# Altium schematic sheet A-GSM.SchDoc
size A3; SheetNumber: 02; SheetTotal: 03; PageSetup: Record=PageOptions|CenterHorizontal=True|CenterVertical=True|PrintScale=1.04|XCorrection=1.00|YCorrection=1.00|PrintKind=1|BorderSize=5000000|LeftOffset=0|BottomOffset=0|Orientation=2|PaperLength=1000|PaperWidth=1000|Scale=100|PaperSource=7|PrintQuality=600|MediaType=1|DitherType=10|PrintScaleMode=1|PaperKind=A3|PaperIndex=8
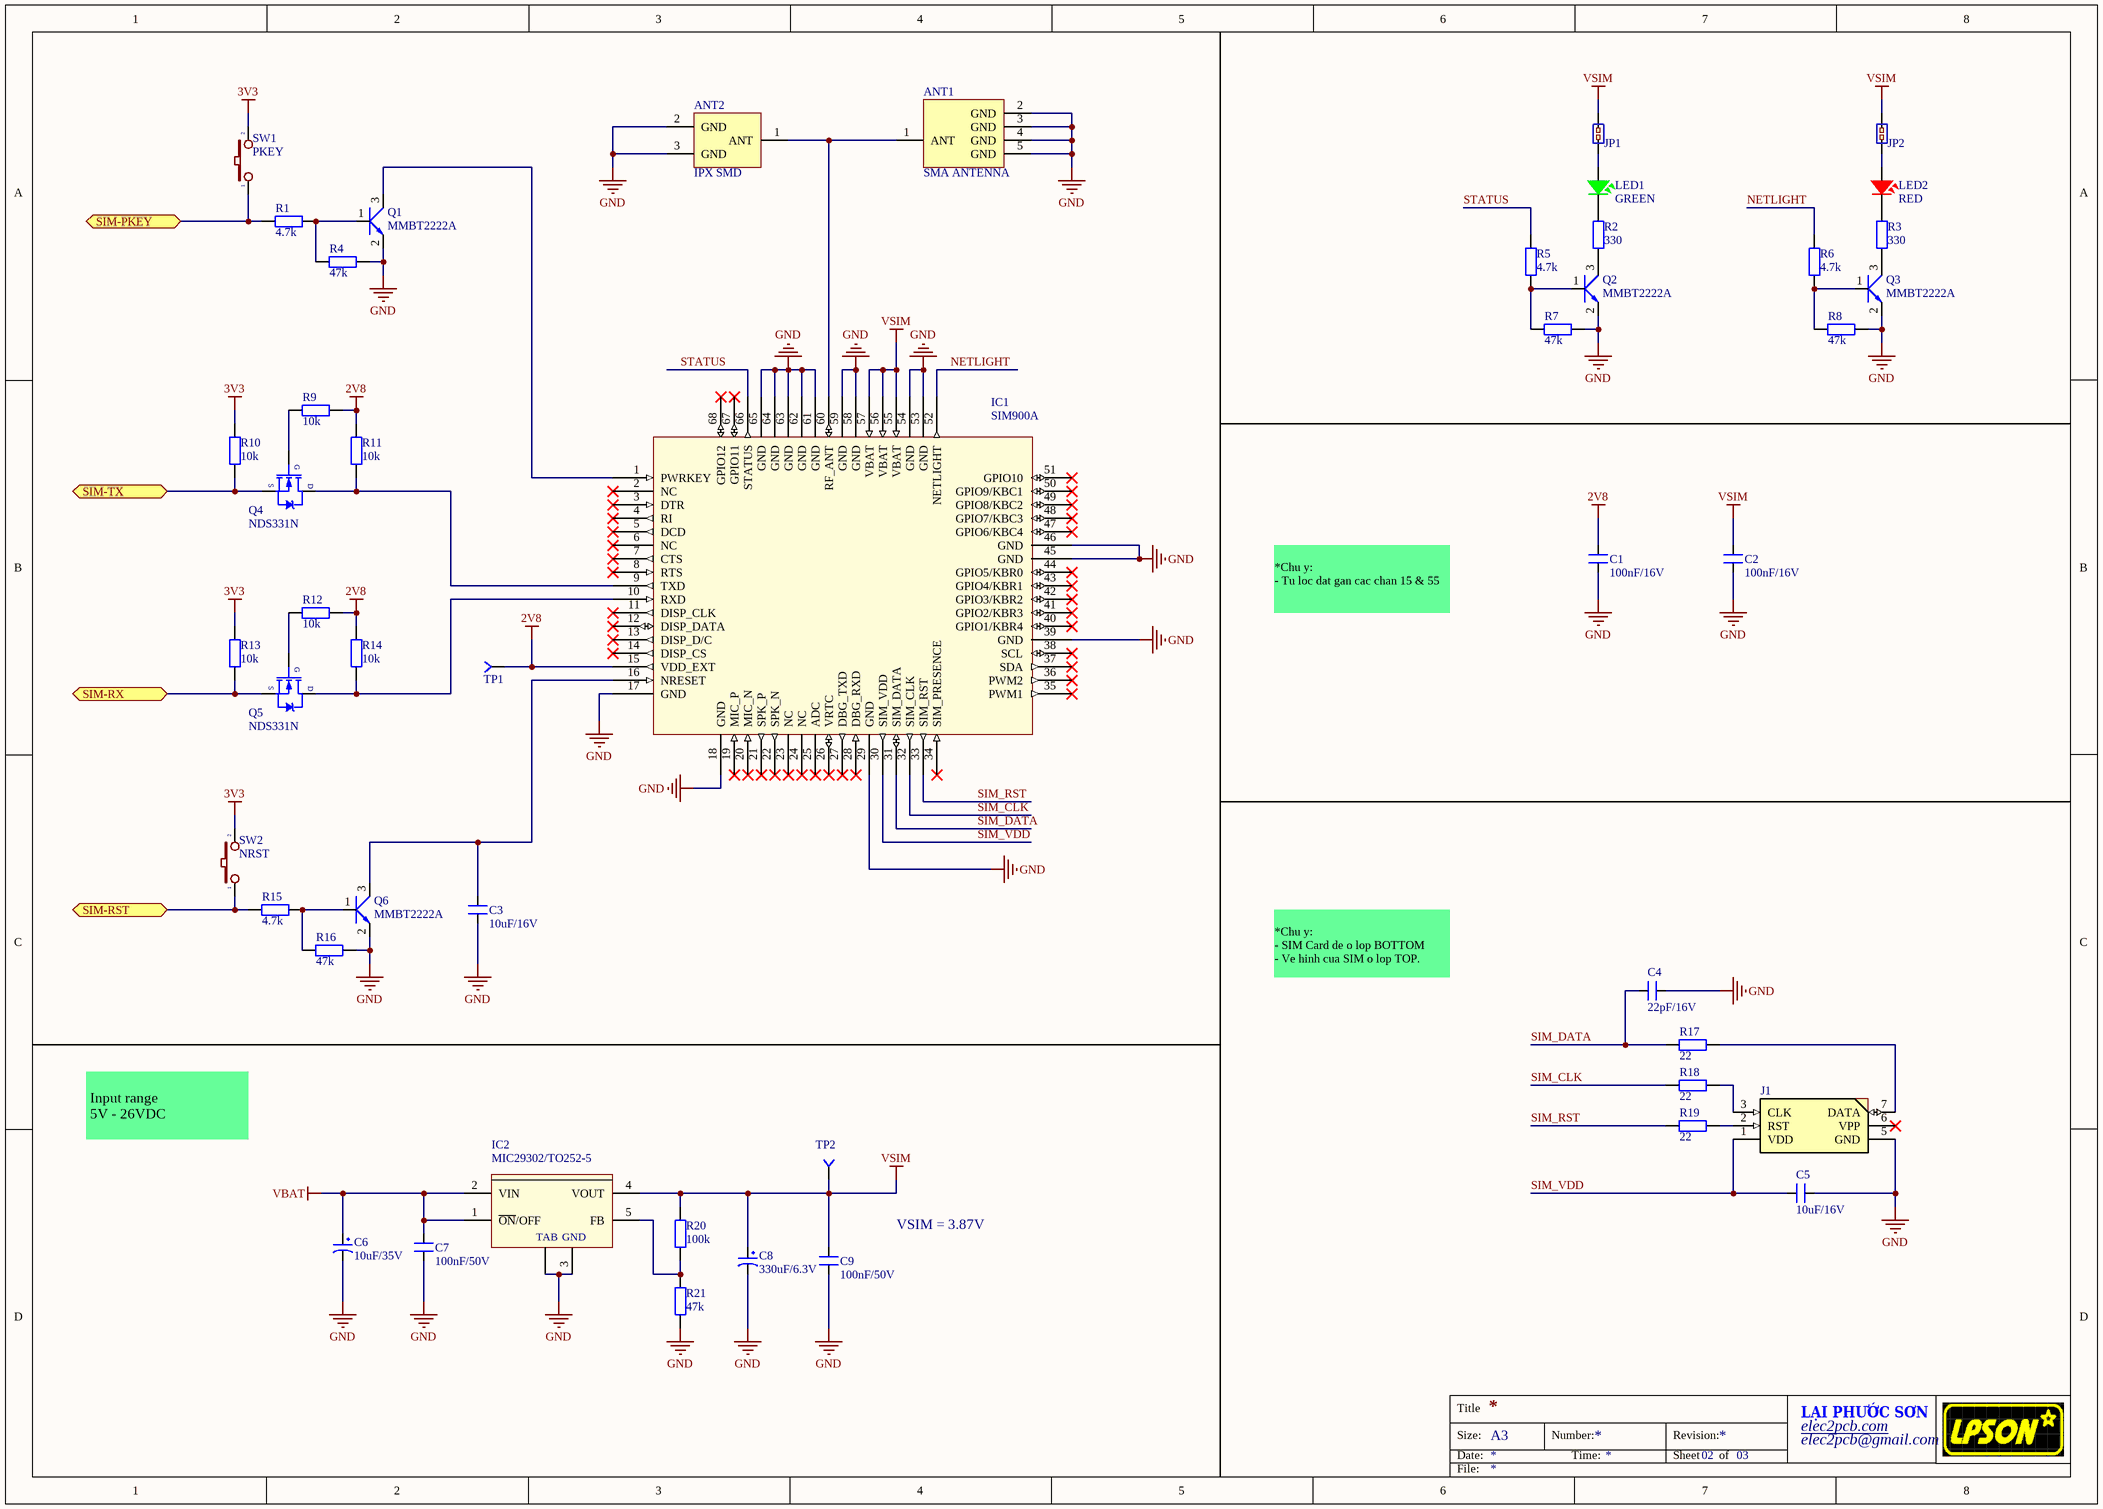
[diagram p0: A-GSM.SchDoc]

## Parts
ANT1  value SMA ANTENNA  [ANT-SMA-ST-F]  (hidden comment: ANTEN-SMA)
ANT2  value IPX SMD  [ANT-IPX-SMD]  (hidden comment: ANTEN-IPX)
C1  100nF/16V  [C0805-2012]
C2  100nF/16V  [C0805-2012]
C3  10uF/16V  [C0805-2012]
C4  22pF/16V  [C0603-1608]
C5  10uF/16V  [C0805-2012]
C6  10uF/35V  [CAP_TANTA_10UF_35V]
C7  100nF/50V  [C0805-2012]
C8  330uF/6.3V  [CAP_TANTA-3528]
C9  100nF/50V  [C0805-2012]
IC1  SIM900A/SIMCOM  [SIM900A]  (value not drawn)
IC2  MIC29302/TO252-5  [MIC29302A]
J1  SIM-FMS006-2620-0  [SIM-FMS006-2620-0]  (value not drawn)
JP1  JP2-ShortingJumper  [Header_2]  (value not drawn)
JP2  JP2-ShortingJumper  [Header_2]  (value not drawn)
LED1  GREEN  [Led 0805G]
LED2  RED  [Led 0805R]
Q1  MMBT2222A  [MMBT2222A]
Q2  MMBT2222A  [MMBT2222A]
Q3  MMBT2222A  [MMBT2222A]
Q4  NDS331N  [NDS331N]
Q5  NDS331N  [NDS331N]
Q6  MMBT2222A  [MMBT2222A]
R1  Resistance (Ohms): 4.7k  [RESC2012(0805)]
R2  Resistance (Ohms): 330  [RESC2012(0805)]
R3  Resistance (Ohms): 330  [RESC2012(0805)]
R4  Resistance (Ohms): 47k  [RESC2012(0805)]
R5  Resistance (Ohms): 4.7k  [RESC2012(0805)]
R6  Resistance (Ohms): 4.7k  [RESC2012(0805)]
R7  Resistance (Ohms): 47k  [RESC2012(0805)]
R8  Resistance (Ohms): 47k  [RESC2012(0805)]
R9  Resistance (Ohms): 10k  [RESC2012(0805)]
R10  Resistance (Ohms): 10k  [RESC2012(0805)]
R11  Resistance (Ohms): 10k  [RESC2012(0805)]
R12  Resistance (Ohms): 10k  [RESC2012(0805)]
R13  Resistance (Ohms): 10k  [RESC2012(0805)]
R14  Resistance (Ohms): 10k  [RESC2012(0805)]
R15  Resistance (Ohms): 4.7k  [RESC2012(0805)]
R16  Resistance (Ohms): 47k  [RESC2012(0805)]
R17  Resistance (Ohms): 22  [RESC2012(0805)]
R18  Resistance (Ohms): 22  [RESC2012(0805)]
R19  Resistance (Ohms): 22  [RESC2012(0805)]
R20  Resistance (Ohms): 100k  [RESC2012(0805)]
R21  Resistance (Ohms): 47k  [RESC2012(0805)]
SW1  PKEY  [BTN-EVQ-11A04M]
SW2  NRST  [BTN-EVQ-11A04M]
TP1  Test Point  [Test_point_VIA06]  (value not drawn)
TP2  Test Point  [Test_point_VIA06]  (value not drawn)

## Ports
SIM-PKEY (bidir), SIM-RST (bidir), SIM-RX (bidir), SIM-TX (bidir)

## Nets
2V8: C1.1 IC1.15(VDD_EXT) R9.2 R11.1 R12.2 R14.1 TP1.1
3V3: R10.1 R13.1 SW1.2 SW2.2
GND: ANT1.2(GND) ANT1.3(GND) ANT1.4(GND) ANT1.5(GND) ANT2.2(GND) ANT2.3(GND) C1.2 C2.2 C3.2 C4.2 C5.2 C6.2 C7.2 C8.2 C9.2 IC1.17(GND) IC1.18(GND) IC1.29(GND) IC1.39(GND) IC1.45(GND) IC1.46(GND) IC1.53(GND) IC1.54(GND) IC1.58(GND) IC1.59(GND) IC1.61(GND) IC1.62(GND) IC1.63(GND) IC1.64(GND) IC1.65(GND) IC2.3(GND) IC2.6(TAB) J1.5(GND) Q1.2(E) Q2.2(E) Q3.2(E) Q6.2(E) R4.2 R7.2 R8.2 R16.2 R21.1
VBAT: C6.1 C7.1 IC2.1(~{ON}/OFF) IC2.2(VIN)
VSIM: C2.1 C8.1 C9.1 IC1.55(VBAT) IC1.56(VBAT) IC1.57(VBAT) IC2.4(VOUT) JP1.2 JP2.2 R20.1 TP2.1
NETLIGHT: IC1.52(NETLIGHT) R6.2
SIM-PKEY: R1.1 SW1.1 ; port SIM-PKEY
SIM-RST: R15.1 SW2.1 ; port SIM-RST
SIM-RX: Q5.2(S) R13.2 ; port SIM-RX
SIM-TX: Q4.2(S) R10.2 ; port SIM-TX
SIM_CLK: IC1.32(SIM_CLK) R18.2
SIM_DATA: C4.1 IC1.31(SIM_DATA) R17.2
SIM_RST: IC1.33(SIM_RST) R19.2
SIM_VDD: C5.1 IC1.30(SIM_VDD) J1.1(VDD)
STATUS: IC1.66(STATUS) R5.2
NetANT1_1: ANT1.1(ANT) ANT2.1(ANT) IC1.60(RF_ANT)
NetC3_1: C3.1 IC1.16(NRESET) Q6.3(C)
NetIC1_1: IC1.1(PWRKEY) Q1.3(C)
NetIC1_9: IC1.9(TXD) Q4.3(D) R11.2
NetIC1_10: IC1.10(RXD) Q5.3(D) R14.2
NetIC2_5: IC2.5(FB) R20.2 R21.2
NetJ1_2: J1.2(RST) R19.1
NetJ1_3: J1.3(CLK) R18.1
NetJ1_7: J1.7(DATA) R17.1
NetJP1_1: JP1.1 LED1.1(A)
NetJP2_1: JP2.1 LED2.1(A)
NetLED1_2: LED1.2(K) R2.2
NetLED2_2: LED2.2(K) R3.2
NetQ1_1: Q1.1(B) R1.2 R4.1
NetQ2_1: Q2.1(B) R5.1 R7.1
NetQ2_3: Q2.3(C) R2.1
NetQ3_1: Q3.1(B) R6.1 R8.1
NetQ3_3: Q3.3(C) R3.1
NetQ4_1: Q4.1(G) R9.1
NetQ5_1: Q5.1(G) R12.1
NetQ6_1: Q6.1(B) R15.2 R16.1

Not connected (* = marked no-connect by the designer): IC1 2(NC)* 3(DTR)* 4(RI)* 5(DCD)* 6(NC)* 7(CTS)* 8(RTS)* 11(DISP_CLK)* 12(DISP_DATA)* 13(DISP_D/C)* 14(DISP_CS)* 19(MIC_P)* 20(MIC_N)* 21(SPK_P)* 22(SPK_N)* 23(NC)* 24(NC)* 25(ADC)* 26(VRTC)* 27(DBG_TXD)* 28(DBG_RXD)* 34(SIM_PRESENCE)* 35(PWM1)* 36(PWM2)* 37(SDA)* 38(SCL)* 40(GPIO1/KBR4)* 41(GPIO2/KBR3)* 42(GPIO3/KBR2)* 43(GPIO4/KBR1)* 44(GPIO5/KBR0)* 47(GPIO6/KBC4)* 48(GPIO7/KBC3)* 49(GPIO8/KBC2)* 50(GPIO9/KBC1)* 51(GPIO10)* 67(GPIO11)* 68(GPIO12)*; J1 6(VPP)*

## Notes on the sheet
- *Chu y:
  - Tu loc dat gan cac chan 15 & 55
- *Chu y:
  - SIM Card de o lop BOTTOM
  - Ve hinh cua SIM o lop TOP.
- Input range
  5V - 26VDC
- VSIM = 3.87V
- Title
- Size:
- Date:
- A3
- Number:
- Time:
- Revision:
- Sheet
- of
- LẠI PHƯỚC SƠN
- elec2pcb@gmail.com
- elec2pcb.com
- File:

## Library data of the parts
ANT1 = ANTEN-SMA: SMA Right-Angle PCB Female Antenna; Supplier Link: http://tme.vn/Product.aspx?id=1981#page=pro_info; ComponentLink1Description: http://tme.vn/upload/PICTURE/SMA-ST-DIM.gif; ComponentLink1URL: http://tme.vn/upload/PICTURE/SMA-ST-DIM.gif; Supplier 1: TME.VN
ANT2 = ANTEN-IPX: IPX, SMD, ANTENNA; Supplier Link: http://tme.vn/Product.aspx?id=1106#page=pro_info; ComponentLink1Description: http://tme.vn/upload/pdf/IPXSM66AL.pdf; ComponentLink1URL: http://tme.vn/upload/pdf/IPXSM66AL.pdf; Supplier 1: TME.VN
C1 C2 = CAP-CER/100nF/16V/X7R/0805: CAP CER 0.1UF 16V X7R 0805; Manufacturer: Kemet; Manufacturer Part Number: C0805C104K4RACTU; Capacitance: 0.10µF; Tolerance: ±10%; Supplier 1: Digi-Key; RoHS: RoHS Compliant; Category: Capacitors; Stock 1: 366123; Pricing 1: 1=0.11, 10=0.075, 50=0.0432, 100=0.0356, 250=0.03, 500=0.02512, 1000=0.02063 (USD); Packaging: Cut Tape (CT); Voltage - Rated: 16V; Temperature Coefficient: X7R; Mounting Type: Surface Mount, MLCC; Operating Temperature: -55°C ~ 125°C; Applications: General Purpose; Ratings: -; Package / Case: 0805 (2012 Metric); Size / Dimension: 0.079" L x 0.049" W (2.00mm x 1.25mm); Height - Seated (Max): -; Thickness (Max): 0.035" (0.88mm); Lead Spacing: -; Features: Low ESL; Lead Style: -; ComponentLink1URL: http://www.kemet.com/docfinder?Partnumber=C0805C104K4RACTU; ComponentLink1Description: http://www.kemet.com/docfinder?Partnumber=C0805C104K4RACTU; Supplier Part Number 1: 399-1167-1-ND
C3 C5 = CAP-CER/10UF/16V/X5R/0805: CAP CER 10UF 16V X5R 0805; Manufacturer: Murata Electronics North America; Manufacturer Part Number: GRM21BR61C106KE15L; Capacitance: 10µF; Tolerance: ±10%; Supplier 1: Digi-Key; Supplier Part Number 1: 490-3886-1-ND; Stock: 1364697; Pricing: 1=0.2, 10=0.136, 50=0.0826, 100=0.0693, 250=0.05612, 500=0.0495, 1000=0.04208 (USD); Packaging: Cut Tape (CT); Voltage - Rated: 16V; Temperature Coefficient: X5R; Mounting Type: Surface Mount, MLCC; Operating Temperature: -55°C ~ 85°C; Applications: General Purpose; Ratings: -; Package / Case: 0805 (2012 Metric); Size / Dimension: 0.079" L x 0.049" W (2.00mm x 1.25mm); Height - Seated (Max): -; Thickness (Max): 0.053" (1.35mm); Lead Spacing: -; Features: -; Lead Style: -; ComponentLink1URL: http://www.murata.com/~/media/webrenewal/support/library/catalog/products/capacitor/mlcc/c02e.ashx; ComponentLink1Description: http://www.murata.com/~/media/webrenewal/support/library/catalog/products/capacitor/mlcc/c02e.ashx
C4 = CAP-CER/22pF/16V/NP0/0603: CAP CER 22PF 16V NP0 0603; Manufacturer: Kemet; Manufacturer Part Number: C0603C220K4GACTU; Tolerance: ±10%; Temperature Coefficient: C0G, NP0; Supplier 1: Digi-Key; Supplier Part Number 1: 399-9031-1-ND; Stock: 40435; Pricing: 1=0.1, 10=0.055, 25=0.0392, 50=0.0298, 100=0.0252, 250=0.02064, 1000=0.0135 (USD); Packaging: Cut Tape (CT); Capacitance: 22pF; Voltage - Rated: 16V; Mounting Type: Surface Mount, MLCC; Operating Temperature: -55°C ~ 125°C; Applications: General Purpose; Ratings: -; Package / Case: 0603 (1608 Metric); Size / Dimension: 0.063" L x 0.031" W (1.60mm x 0.80mm); Height - Seated (Max): -; Thickness (Max): 0.034" (0.87mm); Lead Spacing: -; Features: -; Lead Style: -; ComponentLink1URL: http://www.kemet.com/docfinder?Partnumber=C0603C220K4GACTU; ComponentLink1Description: http://www.kemet.com/docfinder?Partnumber=C0603C220K4GACTU
C6 = CAP-TANT/10uF/35V/2413: CAP TANT 10UF 35V 10% 2413; Manufacturer: Kemet; Manufacturer Part Number: T491C106K035AT; Manufacturer Size Code: C; Capacitance: 10µF; ESR (Equivalent Series Resistance): 1.6 Ohm; Type: Molded; Lifetime @ Temp.: 2000 Hrs @ 85°C; Supplier 1: Digi-Key; RoHS: RoHS Compliant; Category: Capacitors; Stock 1: 21227; Pricing 1: 1=0.99, 10=0.838, 50=0.6166, 100=0.4901, 250=0.41108 (USD); Packaging: Cut Tape (CT); Tolerance: ±10%; Voltage - Rated: 35V; Operating Temperature: -55°C ~ 125°C; Mounting Type: Surface Mount; Package / Case: 2413 (6032 Metric); Size / Dimension: 0.236" L x 0.126" W (6.00mm x 3.20mm); Height - Seated (Max): 0.110" (2.80mm); Lead Spacing: -; Features: General Purpose; ComponentLink1URL: http://www.kemet.com/Lists/ProductCatalog/Attachments/254/KEM_T2005_T491.pdf; ComponentLink1Description: http://www.kemet.com/Lists/ProductCatalog/Attachments/254/KEM_T2005_T491.pdf; Supplier Part Number 1: 399-8333-1-ND
C7 C9 = CAP-CER/100nF/50V/X7R/0805: CAP CER 0.1UF 50V X7R 0805; Manufacturer: AVX Corporation; Manufacturer Part Number: 08055C104KAT2A; Capacitance: 0.10µF; Tolerance: ±10%; Supplier 1: Digi-Key; RoHS: RoHS Compliant; Category: Capacitors; Stock 1: 6127704; Pricing 1: 1=0.1, 10=0.036, 100=0.0165, 250=0.01352, 500=0.01156, 1000=0.009 (USD); Packaging: Cut Tape (CT); Voltage - Rated: 50V; Temperature Coefficient: X7R; Mounting Type: Surface Mount, MLCC; Operating Temperature: -55°C ~ 125°C; Applications: General Purpose; Ratings: -; Package / Case: 0805 (2012 Metric); Size / Dimension: 0.079" L x 0.049" W (2.01mm x 1.25mm); Height - Seated (Max): -; Thickness (Max): 0.037" (0.94mm); Lead Spacing: -; Features: -; Lead Style: -; ComponentLink1URL: http://datasheets.avx.com/X7RDielectric.pdf; ComponentLink1Description: http://datasheets.avx.com/X7RDielectric.pdf; Supplier Part Number 1: 478-1395-1-ND
C8 = CAP-TANT/330uF/6.3V/3528: CAP TAN 330UF 20% 6V 3528-21; Manufacturer: Kemet; Manufacturer Part Number: T490B337M006ATE800; Manufacturer Size Code: B; Capacitance: 330µF; Voltage - Rated: 6.3V; ESR (Equivalent Series Resistance): 800 mOhm; Type: Molded; Lifetime @ Temp.: 1000 Hrs @ 85°C; Supplier 1: Digi-Key; RoHS: RoHS Compliant; Category: Capacitors; Stock 1: 5471; Pricing 1: 1=1.21, 10=1.011, 50=0.817, 100=0.645, 250=0.53752, 500=0.48376, 1000=0.44075 (USD); Packaging: Cut Tape (CT); Tolerance: ±20%; Operating Temperature: -55°C ~ 40°C; Mounting Type: Surface Mount; Package / Case: 1411 (3528 Metric); Size / Dimension: 0.138" L x 0.110" W (3.50mm x 2.80mm); Height - Seated (Max): 0.083" (2.10mm); Lead Spacing: -; Features: General Purpose; ComponentLink1URL: http://capacitoredge.kemet.com/capedge2/DataSheet?pn=T490B337M006ATE800; ComponentLink1Description: http://capacitoredge.kemet.com/capedge2/DataSheet?pn=T490B337M006ATE800; Supplier Part Number 1: 399-11976-1-ND
IC1 = SIM900A/SIMCOM: SIM900A, Dual-band GSM/GPRS 900/1800MHz Module; Manufacturer: SIMCOM; ComponentLink1Description: http://www.tme.vn/upload/pdf/SIM900A_HD_V1.01.pdf; Supplier Link: http://www.tme.vn/Product.aspx?id=1575#page=pro_info; ComponentLink1URL: http://www.tme.vn/upload/pdf/SIM900A_HD_V1.01.pdf; Manufacturer Part Number: SIM900A
IC2 = MIC29302/TO252-5: IC REG LDO ADJ 3A TO252-5; Manufacturer: Microchip Technology; Manufacturer Part Number: MIC29302AWD-TR; Regulator Topology: Positive Adjustable; Voltage - Output: 1.24 V ~ 15 V; Voltage - Dropout (Typical): 0.45V @ 3A; Number of Regulators: 1; Voltage - Input: 3 V ~ 16 V; Datasheet: http://www.micrel.com/_PDF/mic29150.pdf; Supplier VN: http://thegioiic.com/products/mic29302; Supplier 1: Digi-Key; RoHS: RoHS Compliant; Category: Integrated Circuits (ICs); Stock 1: 4076; Pricing 1: 1=1.87, 25=1.56, 100=1.42 (USD); Packaging: Cut Tape (CT); Current - Output: 3A; Current - Limit (Min): 3A; Operating Temperature: -40°C ~ 125°C; Mounting Type: Surface Mount; Package / Case: TO-263-6, D²Pak (5 Leads + Tab), TO-263BA; Supplier Device Package: TO-252-5; ComponentLink1URL: http://www.microchip.com/mymicrochip/filehandler.aspx?ddocname=en580808; ComponentLink1Description: http://www.microchip.com/mymicrochip/filehandler.aspx?ddocname=en580808; Supplier Part Number 1: 576-4106-1-ND
J1 = SIM-FMS006-2620-0: SIM Card Conn 6-Pin Top, Mount, Push-Push; Manufacturer Part Number 1: FMS006-2620-0; Supplier Link: http://tme.vn/Product.aspx?id=599#page=pro_info; ComponentLink1Description: http://www.mouser.com/ds/2/448/c_fms006_2620-4530.pdf; ComponentLink1URL: http://www.mouser.com/ds/2/448/c_fms006_2620-4530.pdf; Supplier 1: TME.VN
JP1 JP2 = JP2-ShortingJumper: 2.54mm 2-Pin Shorting Jumper; Value: Shorting Jumper; Supplier Link: http://tme.vn/Product.aspx?id=509#page=pro_info
LED1 = LED-GREEN/CLEAR/0805: LED GREEN CLEAR 0805 SMD; Manufacturer: Lite-On Inc.; Manufacturer Part Number: LTST-C171GKT; Wavelength - Dominant: 569nm; Wavelength - Peak: 565nm; Millicandela Rating: 12mcd; Voltage - Forward (Vf) (Typ): 2.1V; Current - Test: 20mA; Viewing Angle: 130°; Lens Color: Colorless; Lens Style/Size: Rectangle with Flat Top, 1.40mm x 1.25mm; Supplier 1: Digi-Key; Supplier Part Number 1: 160-1423-1-ND; Stock: 159350; Pricing: 1=0.25, 10=0.2, 100=0.1091, 250=0.07272, 500=0.06182, 1000=0.04727 (USD); Packaging: Cut Tape (CT); Color: Green; Lens Transparency: Clear; Package / Case: 0805 (2012 Metric); Supplier Device Package: Chip LED; Size / Dimension: 2.00mm L x 1.25mm W; Height (Max): 0.80mm; Mounting Type: Surface Mount; ComponentLink1URL: http://media.digikey.com/pdf/Data%20Sheets/Lite-On%20PDFs/LTST-C171GKT.pdf; ComponentLink1Description: http://media.digikey.com/pdf/Data%20Sheets/Lite-On%20PDFs/LTST-C171GKT.pdf
LED2 = LED-RED/CLEAR/0805: LED RED CLEAR 0805 SMD; Manufacturer: Lite-On Inc.; Manufacturer Part Number: LTST-C171KRKT; Wavelength - Dominant: 631nm; Wavelength - Peak: 639nm; Millicandela Rating: 54mcd; Voltage - Forward (Vf) (Typ): 2V; Current - Test: 20mA; Viewing Angle: 130°; Lens Color: Colorless; Lens Style/Size: Rectangle with Flat Top, 1.40mm x 1.25mm; Supplier 1: Digi-Key; Supplier Part Number 1: 160-1427-1-ND; Stock: 74706; Pricing: 1=0.27, 10=0.213, 100=0.1161, 250=0.0774, 500=0.0658, 1000=0.05031 (USD); Packaging: Cut Tape (CT); Color: Red; Lens Transparency: Clear; Package / Case: 0805 (2012 Metric); Supplier Device Package: *; Size / Dimension: 2.00mm L x 1.25mm W; Height (Max): 0.80mm; Mounting Type: Surface Mount; ComponentLink1URL: http://optoelectronics.liteon.com/upload/download/DS22-2000-109/S_110_LTST-C171KRKT.pdf; ComponentLink1Description: http://optoelectronics.liteon.com/upload/download/DS22-2000-109/S_110_LTST-C171KRKT.pdf
Q1-Q3 Q6 = BJT-MMBT2222A/SOT23: TRANS NPN 40V 0.6A SOT23; Manufacturer: ON Semiconductor; Manufacturer Part Number: MMBT2222ALT1G; Current - Collector (Ic) (Max): 600mA; Vce Saturation (Max) @ Ib, Ic: 1V @ 50mA, 500mA; Current - Collector Cutoff (Max): 10nA (ICBO); DC Current Gain (hFE) (Min) @ Ic, Vce: 100 @ 150mA, 10V; Power - Max: 300mW; Frequency - Transition: 300MHz; Supplier 1: Digi-Key; RoHS: RoHS Compliant; Category: Discrete Semiconductor Products; Stock 1: 416765; Pricing 1: 1=0.1, 10=0.095, 100=0.0516, 500=0.03172, 1000=0.02163 (USD); Packaging: Cut Tape (CT); Transistor Type: NPN; Voltage - Collector Emitter Breakdown (Max): 40V; Mounting Type: Surface Mount; Package / Case: TO-236-3, SC-59, SOT-23-3; Supplier Device Package: SOT-23; ComponentLink1URL: http://www.onsemi.com/pub_link/Collateral/MMBT2222LT1-D.PDF; ComponentLink1Description: http://www.onsemi.com/pub_link/Collateral/MMBT2222LT1-D.PDF; Supplier Part Number 1: MMBT2222ALT1GOSCT-ND
Q4 Q5 = MOSFET-NDS331N/SSOT3: MOSFET N-CH 20V 1.3A SSOT3; Manufacturer: Fairchild Semiconductor; FET Type: MOSFET N-Channel, Metal Oxide; FET Feature: Logic Level Gate; Current - Continuous Drain (Id) @ 25°C: 1.3A (Ta); Rds On (Max) @ Id, Vgs: 160 mOhm @ 1.5A, 4.5V; Vgs(th) (Max) @ Id: 1V @ 250µA; Gate Charge (Qg) @ Vgs: 5nC @ 4.5V; Input Capacitance (Ciss) @ Vds: 162pF @ 10V; Power - Max: 460mW; Supplier 1: Digi-Key; Manufacturer Part Number: NDS331N; RoHS: RoHS Compliant; Category: Discrete Semiconductor Products; Stock 1: 10641; Pricing 1: 1=0.44, 10=0.33, 100=0.2058, 500=0.1407, 1000=0.10815 (USD); Packaging: Cut Tape (CT); Drain to Source Voltage (Vdss): 20V; Operating Temperature: -55°C ~ 150°C (TJ); Mounting Type: Surface Mount; Package / Case: TO-236-3, SC-59, SOT-23-3; Supplier Device Package: SuperSOT-3; ComponentLink1URL: http://www.fairchildsemi.com/datasheets/ND/NDS331N.pdf; ComponentLink1Description: http://www.fairchildsemi.com/datasheets/ND/NDS331N.pdf; Supplier Part Number 1: NDS331NCT-ND
R1 R5 R6 R15 = RES-0805/±5%: RES SMD 4.7K OHM 5% 1/8W 0805; Manufacturer: Yageo; Manufacturer Part Number: RC0805JR-074K7L; Power (Watts): 0.125W, 1/8W; Temperature Coefficient: ±100ppm/°C; Supplier 1: Digi-Key; Supplier Part Number 1: 311-4.7KARCT-ND; RoHS: RoHS Compliant; Category: Resistors; Stock 1: 891032; Pricing 1: 1=0.1, 10=0.018, 25=0.0128, 100=0.0073, 250=0.00556, 500=0.00444, 1000=0.00326, 2500=0.00283 (USD); Packaging: Cut Tape (CT); Tolerance: ±5%; Composition: Thick Film; Features: Moisture Resistant; Operating Temperature: -55°C ~ 155°C; Package / Case: 0805 (2012 Metric); Supplier Device Package: 0805; Size / Dimension: 0.079" L x 0.049" W (2.00mm x 1.25mm); Height: 0.024" (0.60mm); Number of Terminations: 2; ComponentLink1URL: http://www.yageo.com/documents/recent/PYu-RC_Group_51_RoHS_L_04.pdf; ComponentLink1Description: http://www.yageo.com/documents/recent/PYu-RC_Group_51_RoHS_L_04.pdf
R2 R3 = RES-0805/±5%: RES SMD 330 OHM 5% 1/8W 0805; Manufacturer: Yageo; Manufacturer Part Number: RC0805JR-07330RL; Power (Watts): 0.125W, 1/8W; Temperature Coefficient: ±100ppm/°C; Supplier 1: Digi-Key; Supplier Part Number 1: 311-330ARCT-ND; RoHS: RoHS Compliant; Category: Resistors; Stock 1: 538867; Pricing 1: 1=0.1, 10=0.018, 25=0.0128, 100=0.0073, 250=0.00556, 500=0.00444, 1000=0.00326, 2500=0.00283 (USD); Packaging: Cut Tape (CT); Tolerance: ±5%; Composition: Thick Film; Features: Moisture Resistant; Operating Temperature: -55°C ~ 155°C; Package / Case: 0805 (2012 Metric); Supplier Device Package: 0805; Size / Dimension: 0.079" L x 0.049" W (2.00mm x 1.25mm); Height: 0.024" (0.60mm); Number of Terminations: 2; ComponentLink1URL: http://www.yageo.com/documents/recent/PYu-RC_Group_51_RoHS_L_04.pdf; ComponentLink1Description: http://www.yageo.com/documents/recent/PYu-RC_Group_51_RoHS_L_04.pdf
R4 R7 R8 R16 R21 = RES-0805/±5%: RES SMD 47K OHM 5% 1/8W 0805; Manufacturer: Yageo; Manufacturer Part Number: RC0805JR-0747KL; Power (Watts): 0.125W, 1/8W; Temperature Coefficient: ±100ppm/°C; Supplier 1: Digi-Key; Supplier Part Number 1: 311-47KARCT-ND; RoHS: RoHS Compliant; Category: Resistors; Stock 1: 595084; Pricing 1: 1=0.1, 10=0.018, 25=0.0128, 100=0.0073, 250=0.00556, 500=0.00444, 1000=0.00326, 2500=0.00283 (USD); Packaging: Cut Tape (CT); Tolerance: ±5%; Composition: Thick Film; Features: Moisture Resistant; Operating Temperature: -55°C ~ 155°C; Package / Case: 0805 (2012 Metric); Supplier Device Package: 0805; Size / Dimension: 0.079" L x 0.049" W (2.00mm x 1.25mm); Height: 0.024" (0.60mm); Number of Terminations: 2; ComponentLink1URL: http://www.yageo.com/documents/recent/PYu-RC_Group_51_RoHS_L_04.pdf; ComponentLink1Description: http://www.yageo.com/documents/recent/PYu-RC_Group_51_RoHS_L_04.pdf
R9-R14 = RES-0805/±5%: RES SMD 10K OHM 5% 1/8W 0805; Manufacturer: Yageo; Manufacturer Part Number: RC0805JR-0710KL; Power (Watts): 0.125W, 1/8W; Temperature Coefficient: ±100ppm/°C; Supplier 1: Digi-Key; Supplier Part Number 1: 311-10KARCT-ND; RoHS: RoHS Compliant; Category: Resistors; Stock 1: 1117583; Pricing 1: 1=0.1, 10=0.018, 25=0.0128, 100=0.0073, 250=0.00556, 500=0.00444, 1000=0.00326, 2500=0.00283 (USD); Packaging: Cut Tape (CT); Tolerance: ±5%; Composition: Thick Film; Features: Moisture Resistant; Operating Temperature: -55°C ~ 155°C; Package / Case: 0805 (2012 Metric); Supplier Device Package: 0805; Size / Dimension: 0.079" L x 0.049" W (2.00mm x 1.25mm); Height: 0.024" (0.60mm); Number of Terminations: 2; ComponentLink1URL: http://www.yageo.com/documents/recent/PYu-RC_Group_51_RoHS_L_04.pdf; ComponentLink1Description: http://www.yageo.com/documents/recent/PYu-RC_Group_51_RoHS_L_04.pdf
R17-R19 = RES-0805/±5%: RES SMD 22 OHM 5% 1/8W 0805; Manufacturer: Yageo; Manufacturer Part Number: RC0805JR-0722RL; Power (Watts): 0.125W, 1/8W; Temperature Coefficient: ±100ppm/°C; Supplier 1: Digi-Key; Supplier Part Number 1: 311-22ARCT-ND; RoHS: RoHS Compliant; Category: Resistors; Stock 1: 128230; Pricing 1: 1=0.1, 10=0.018, 25=0.0128, 100=0.0073, 250=0.00556, 500=0.00444, 1000=0.00326, 2500=0.00283 (USD); Packaging: Cut Tape (CT); Tolerance: ±5%; Composition: Thick Film; Features: Moisture Resistant; Operating Temperature: -55°C ~ 155°C; Package / Case: 0805 (2012 Metric); Supplier Device Package: 0805; Size / Dimension: 0.079" L x 0.049" W (2.00mm x 1.25mm); Height: 0.024" (0.60mm); Number of Terminations: 2; ComponentLink1URL: http://www.yageo.com/documents/recent/PYu-RC_Group_51_RoHS_L_04.pdf; ComponentLink1Description: http://www.yageo.com/documents/recent/PYu-RC_Group_51_RoHS_L_04.pdf
R20 = RES-0805/±5%: RES SMD 100K OHM 5% 1/8W 0805; Manufacturer: Yageo; Manufacturer Part Number: RC0805JR-07100KL; Power (Watts): 0.125W, 1/8W; Temperature Coefficient: ±100ppm/°C; Supplier 1: Digi-Key; Supplier Part Number 1: 311-100KARCT-ND; RoHS: RoHS Compliant; Category: Resistors; Stock 1: 312208; Pricing 1: 1=0.1, 10=0.018, 25=0.0128, 100=0.0073, 250=0.00556, 500=0.00444, 1000=0.00326, 2500=0.00283 (USD); Packaging: Cut Tape (CT); Tolerance: ±5%; Composition: Thick Film; Features: Moisture Resistant; Operating Temperature: -55°C ~ 155°C; Package / Case: 0805 (2012 Metric); Supplier Device Package: 0805; Size / Dimension: 0.079" L x 0.049" W (2.00mm x 1.25mm); Height: 0.024" (0.60mm); Number of Terminations: 2; ComponentLink1URL: http://www.yageo.com/documents/recent/PYu-RC_Group_51_RoHS_L_04.pdf; ComponentLink1Description: http://www.yageo.com/documents/recent/PYu-RC_Group_51_RoHS_L_04.pdf
SW1 SW2 = SW2-PUSH/SPST/NO: SWITCH TACTILE SPST-NO 0.02A 15V; Manufacturer: Panasonic Electronic Components; Manufacturer Part Number: EVQ-11A04M; Switch Function: Off-Mom; Contact Rating @ Voltage: 0.02A @ 15VDC; Actuator Type: Standard; Actuator Height off PCB, from Pins: 4.30mm; Actuator Orientation: Top Actuated; Outline: 6.00mm x 6.00mm; Illumination: Non-Illuminated; Operating Force: 100gf; Switch Travel: 0.25mm; Mechanical Life: 100,000 Cycles; Supplier 1: Digi-Key; RoHS: RoHS Compliant; Category: Switches; Stock 1: 4758; Pricing 1: 1=0.29, 10=0.273, 25=0.2344, 50=0.1992, 100=0.1913, 250=0.17184, 500=0.16402, 1000=0.13668 (USD); Packaging: Cut Tape (CT); Circuit: SPST-NO; Mounting Type: Through Hole; Termination Style: PC Pin; Illumination Voltage (Nominal): -; Illumination Type, Color: -; Ingress Protection: -; Features: -; Actuator Material: -; Operating Temperature: -20°C ~ 70°C; ComponentLink1URL: http://industrial.panasonic.com/cdbs/www-data/pdf/ATK0000/ATK0000CE11.pdf; ComponentLink1Description: http://industrial.panasonic.com/cdbs/www-data/pdf/ATK0000/ATK0000CE11.pdf; Supplier Part Number 1: P8070SCT-ND
TP1 TP2 = Connector-TP: Test Point, Pad, Hole; Value: Not a component